# Altium schematic sheet step-dir-opto.SchDoc
size A4
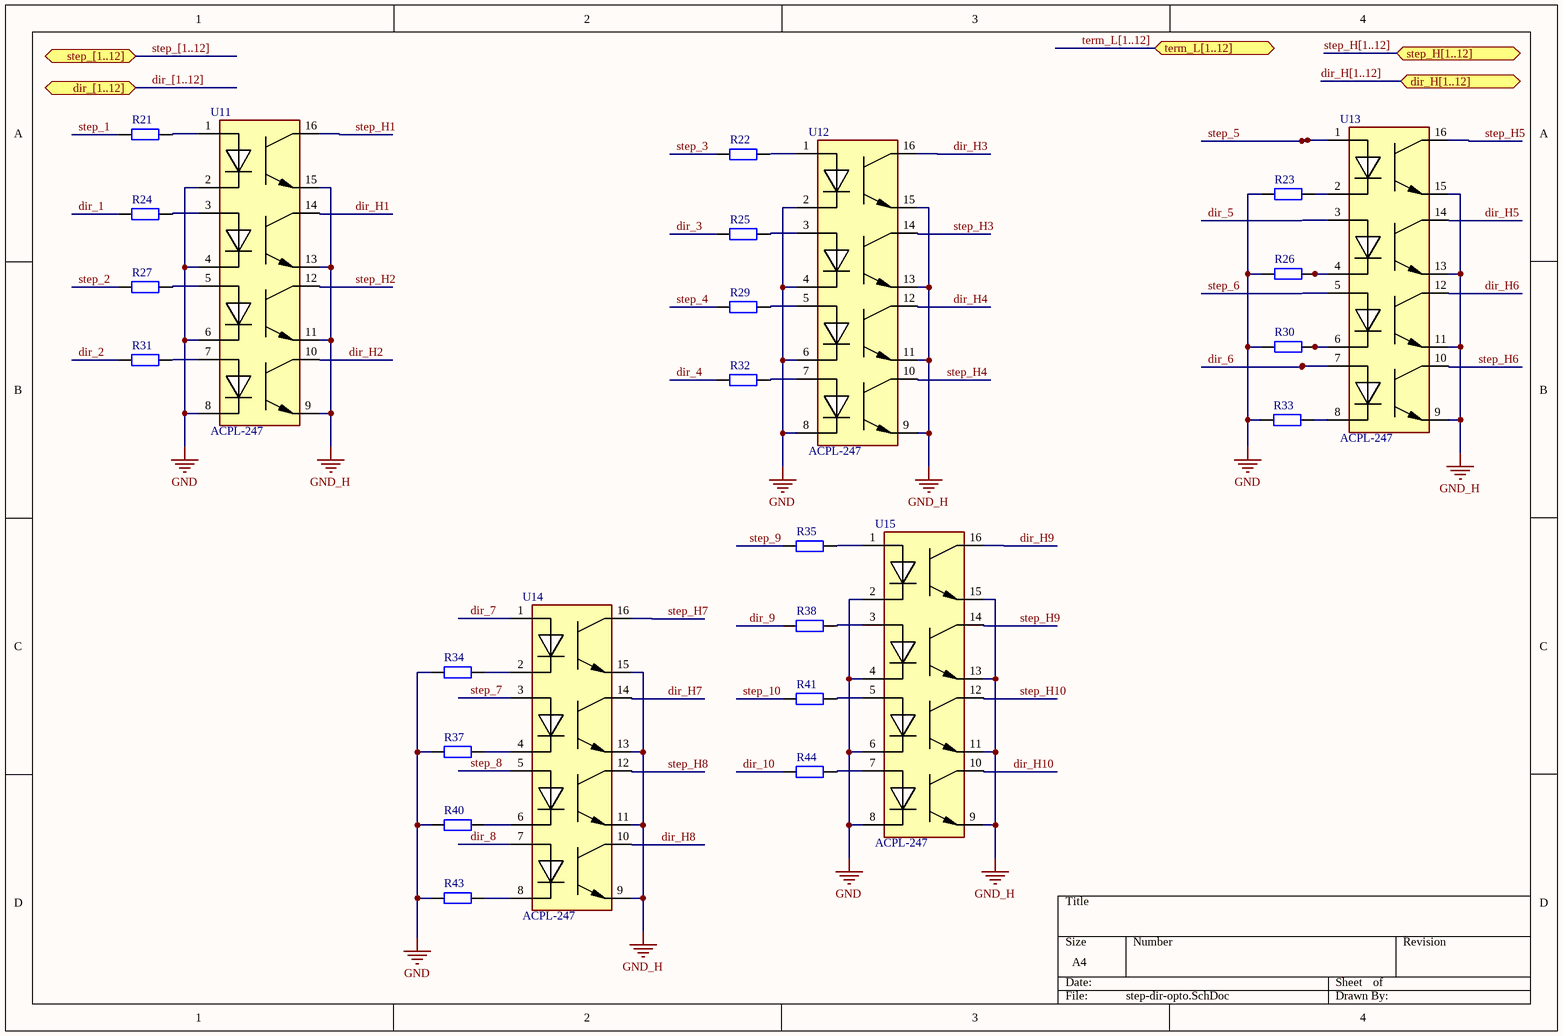
[diagram p0: step-dir-opto.SchDoc]

## Parts
R21  Res2  [RESC2012M]  (value not drawn)
R22  Res2  [RESC2012M]  (value not drawn)
R23  Res2  [RESC2012M]  (value not drawn)
R24  Res2  [RESC2012M]  (value not drawn)
R25  Res2  [RESC2012M]  (value not drawn)
R26  Res2  [RESC2012M]  (value not drawn)
R27  Res2  [RESC2012M]  (value not drawn)
R29  Res2  [RESC2012M]  (value not drawn)
R30  Res2  [RESC2012M]  (value not drawn)
R31  Res2  [RESC2012M]  (value not drawn)
R32  Res2  [RESC2012M]  (value not drawn)
R33  Res2  [RESC2012M]  (value not drawn)
R34  Res2  [RESC2012M]  (value not drawn)
R35  Res2  [RESC2012M]  (value not drawn)
R37  Res2  [RESC2012M]  (value not drawn)
R38  Res2  [RESC2012M]  (value not drawn)
R40  Res2  [RESC2012M]  (value not drawn)
R41  Res2  [RESC2012M]  (value not drawn)
R43  Res2  [RESC2012M]  (value not drawn)
R44  Res2  [RESC2012M]  (value not drawn)
U11  ACPL-247  [SOIC127P600-16M]
U12  ACPL-247  [SOIC127P600-16M]
U13  ACPL-247  [SOIC127P600-16M]
U14  ACPL-247  [SOIC127P600-16M]
U15  ACPL-247  [SOIC127P600-16M]

## Ports
dir_[1..12], dir_H[1..12], step_[1..12], step_H[1..12], term_L[1..12]

## Nets
GND: R23.1 R26.1 R30.1 R33.1 R34.1 R37.1 R40.1 R43.1 U11.2 U11.4 U11.6 U11.8 U12.2 U12.4 U12.6 U12.8 U15.2 U15.4 U15.6 U15.8
GND_H: U11.9 U11.11 U11.13 U11.15 U12.9 U12.11 U12.13 U12.15 U13.9 U13.11 U13.13 U13.15 U14.9 U14.11 U14.13 U14.15 U15.9 U15.11 U15.13 U15.15
dir_1: R24.1
dir_2: R31.1
dir_3: R25.1
dir_4: R32.1
dir_5: U13.3
dir_6: U13.7
dir_7: U14.1
dir_8: U14.7
dir_9: R38.1
dir_10: R44.1
dir_H1: U11.14
dir_H2: U11.10
dir_H3: U12.16
dir_H4: U12.12
dir_H5: U13.14
dir_H6: U13.12
dir_H7: U14.14
dir_H8: U14.10
dir_H9: U15.16
dir_H10: U15.10
step_1: R21.1
step_2: R27.1
step_3: R22.1
step_4: R29.1
step_5: U13.1
step_6: U13.5
step_7: U14.3
step_8: U14.5
step_9: R35.1
step_10: R41.1
step_H1: U11.16
step_H2: U11.12
step_H3: U12.14
step_H4: U12.10
step_H5: U13.16
step_H6: U13.10
step_H7: U14.16
step_H8: U14.12
step_H9: U15.14
step_H10: U15.12
NetR21_2: R21.2 U11.1
NetR22_2: R22.2 U12.1
NetR23_2: R23.2 U13.2
NetR24_2: R24.2 U11.3
NetR25_2: R25.2 U12.3
NetR26_2: R26.2 U13.4
NetR27_2: R27.2 U11.5
NetR29_2: R29.2 U12.5
NetR30_2: R30.2 U13.6
NetR31_2: R31.2 U11.7
NetR32_2: R32.2 U12.7
NetR33_2: R33.2 U13.8
NetR34_2: R34.2 U14.2
NetR35_2: R35.2 U15.1
NetR37_2: R37.2 U14.4
NetR38_2: R38.2 U15.3
NetR40_2: R40.2 U14.6
NetR41_2: R41.2 U15.5
NetR43_2: R43.2 U14.8
NetR44_2: R44.2 U15.7

## Buses and harness runs
bus dir_[1..12] = port dir_[1..12]
bus dir_H[1..12] = port dir_H[1..12]
bus step_[1..12] = port step_[1..12]
bus step_H[1..12] = port step_H[1..12]
bus term_L[1..12] = port term_L[1..12]

## Library data of the parts
R21-R27 R29-R35 R37 R38 R40 R41 R43 R44 = Res2: Resistor; Value: 1K; Published: 8-Jun-2000; LatestRevisionDate: 17-Jul-2002; LatestRevisionNote: Re-released for DXP Platform.; PackageReference: AXIAL-0.4; Publisher: Altium Limited; PackageDescription: Axial Device, Thru-Hole; 2 Leads; 0.4 in Pin Spacing
U11-U15 = ACPL-247: DC Input Multi-Channel Half-Pitch  Phototransistor Optocoupler